# Altium schematic sheet ADCS2Umb.SchDoc
size A
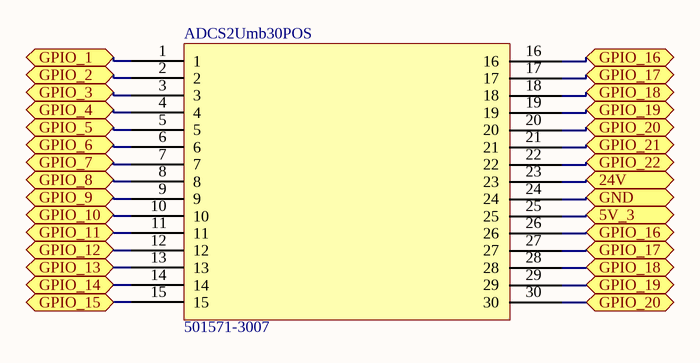
[diagram p0: ADCS2Umb.SchDoc]

## Parts
ADCS2Umb30POS  501571-3007  [Docking_Molex_30Pin]

## Ports
5V_3 (bidir), 24V (bidir), GND (bidir), GPIO_1 (bidir), GPIO_2 (bidir), GPIO_3 (bidir), GPIO_4 (bidir), GPIO_5 (bidir), GPIO_6 (bidir), GPIO_7 (bidir), GPIO_8 (bidir), GPIO_9 (bidir), GPIO_10 (bidir), GPIO_11 (bidir), GPIO_12 (bidir), GPIO_13 (bidir), GPIO_14 (bidir), GPIO_15 (bidir), GPIO_16 (bidir), GPIO_17 (bidir), GPIO_18 (bidir), GPIO_19 (bidir), GPIO_20 (bidir), GPIO_21 (bidir), GPIO_22 (bidir)

## Nets
5V_3: ADCS2Umb30POS.25 ; port 5V_3
24V: ADCS2Umb30POS.23 ; port 24V
GND: ADCS2Umb30POS.24 ; port GND
GPIO_1: ADCS2Umb30POS.1 ; port GPIO_1
GPIO_2: ADCS2Umb30POS.2 ; port GPIO_2
GPIO_3: ADCS2Umb30POS.3 ; port GPIO_3
GPIO_4: ADCS2Umb30POS.4 ; port GPIO_4
GPIO_5: ADCS2Umb30POS.5 ; port GPIO_5
GPIO_6: ADCS2Umb30POS.6 ; port GPIO_6
GPIO_7: ADCS2Umb30POS.7 ; port GPIO_7
GPIO_8: ADCS2Umb30POS.8 ; port GPIO_8
GPIO_9: ADCS2Umb30POS.9 ; port GPIO_9
GPIO_10: ADCS2Umb30POS.10 ; port GPIO_10
GPIO_11: ADCS2Umb30POS.11 ; port GPIO_11
GPIO_12: ADCS2Umb30POS.12 ; port GPIO_12
GPIO_13: ADCS2Umb30POS.13 ; port GPIO_13
GPIO_14: ADCS2Umb30POS.14 ; port GPIO_14
GPIO_15: ADCS2Umb30POS.15 ; port GPIO_15
GPIO_16: ADCS2Umb30POS.16 ADCS2Umb30POS.26 ; port GPIO_16
GPIO_17: ADCS2Umb30POS.17 ADCS2Umb30POS.27 ; port GPIO_17
GPIO_18: ADCS2Umb30POS.18 ADCS2Umb30POS.28 ; port GPIO_18
GPIO_19: ADCS2Umb30POS.19 ADCS2Umb30POS.29 ; port GPIO_19
GPIO_20: ADCS2Umb30POS.20 ADCS2Umb30POS.30 ; port GPIO_20
GPIO_21: ADCS2Umb30POS.21 ; port GPIO_21
GPIO_22: ADCS2Umb30POS.22 ; port GPIO_22

## Library data of the parts
ADCS2Umb30POS = 501571-3007: ADCS2Umb30POS